# EAGLE design XBP-ST_morpho (EAGLE 7.2.0)
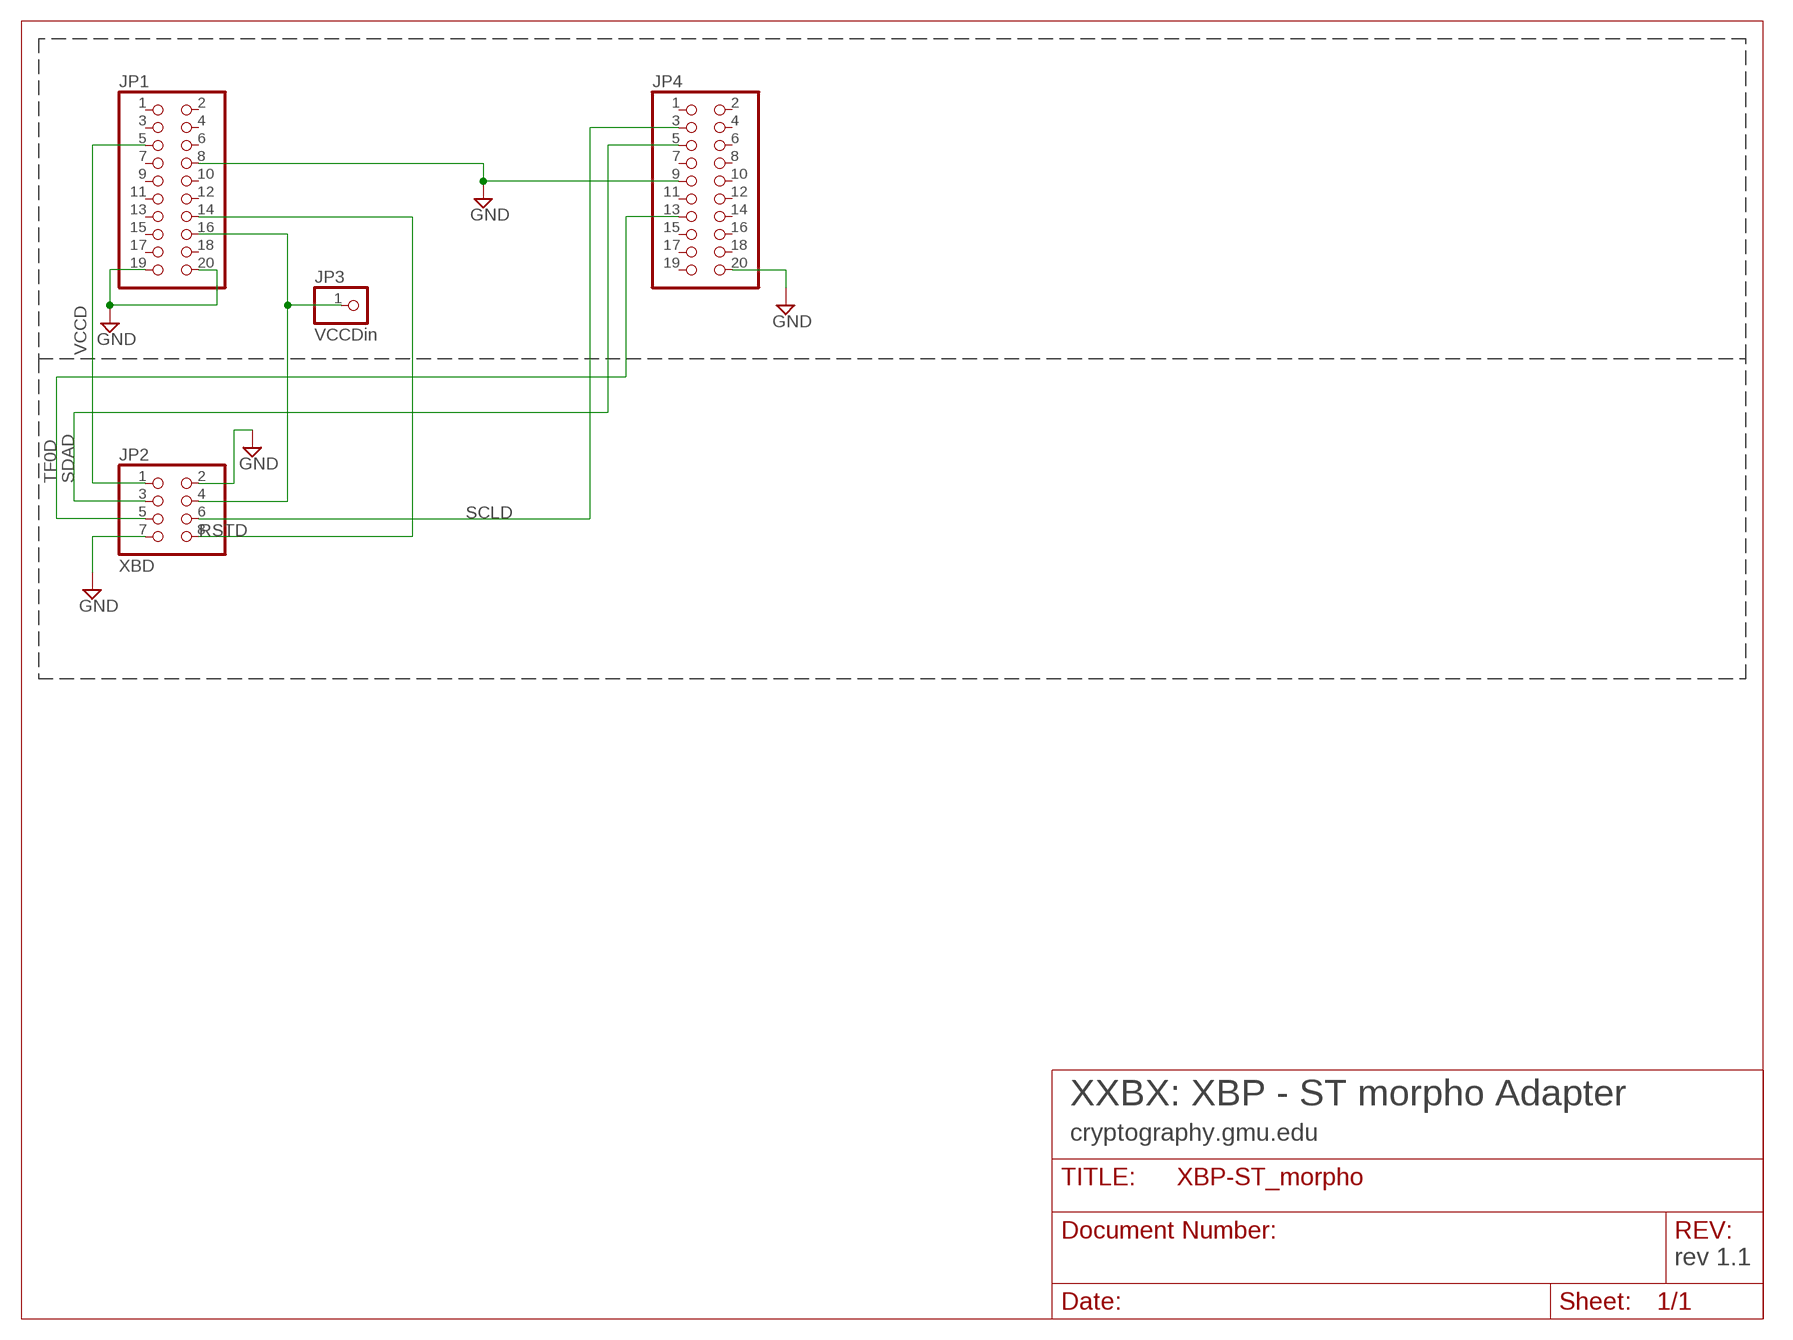
[diagram p0: schematic, sheet 1]

## Parts
JP1  PINHD-2X10  [2X10]
JP2  XBD  PINHD-2X4/90  [2X04/90]
JP3  VCCDin  PINHD-1X1  [1X01]
JP4  PINHD-2X10  [2X10]

## Nets
GND: JP1.8 JP1.19 JP1.20 JP2.2 JP2.7 JP4.9 JP4.20
N$6: JP1.16 JP2.4 JP3.1
RSTD: JP1.14 JP2.8
SCLD: JP2.6 JP4.3
SDAD: JP2.3 JP4.5
TF0D: JP2.5 JP4.13
VCCD: JP1.5 JP2.1
Unconnected: JP1.1 JP1.2 JP1.3 JP1.4 JP1.6 JP1.7 JP1.9 JP1.10 JP1.11 JP1.12 JP1.13 JP1.15 JP1.17 JP1.18 JP4.1 JP4.2 JP4.4 JP4.6 JP4.7 JP4.8 JP4.10 JP4.11 JP4.12 JP4.14 JP4.15 JP4.16 JP4.17 JP4.18 JP4.19

## Notes on the sheet
- XXBX: XBP - ST morpho Adapter
- cryptography.gmu.edu
- rev 1.1

## Library data of the parts
JP1 JP4 = pinhead:PINHD-2X10: PIN HEADER
JP2 = pinhead:PINHD-2X4: PIN HEADER
JP3 = pinhead:PINHD-1X1: PIN HEADER

## Board
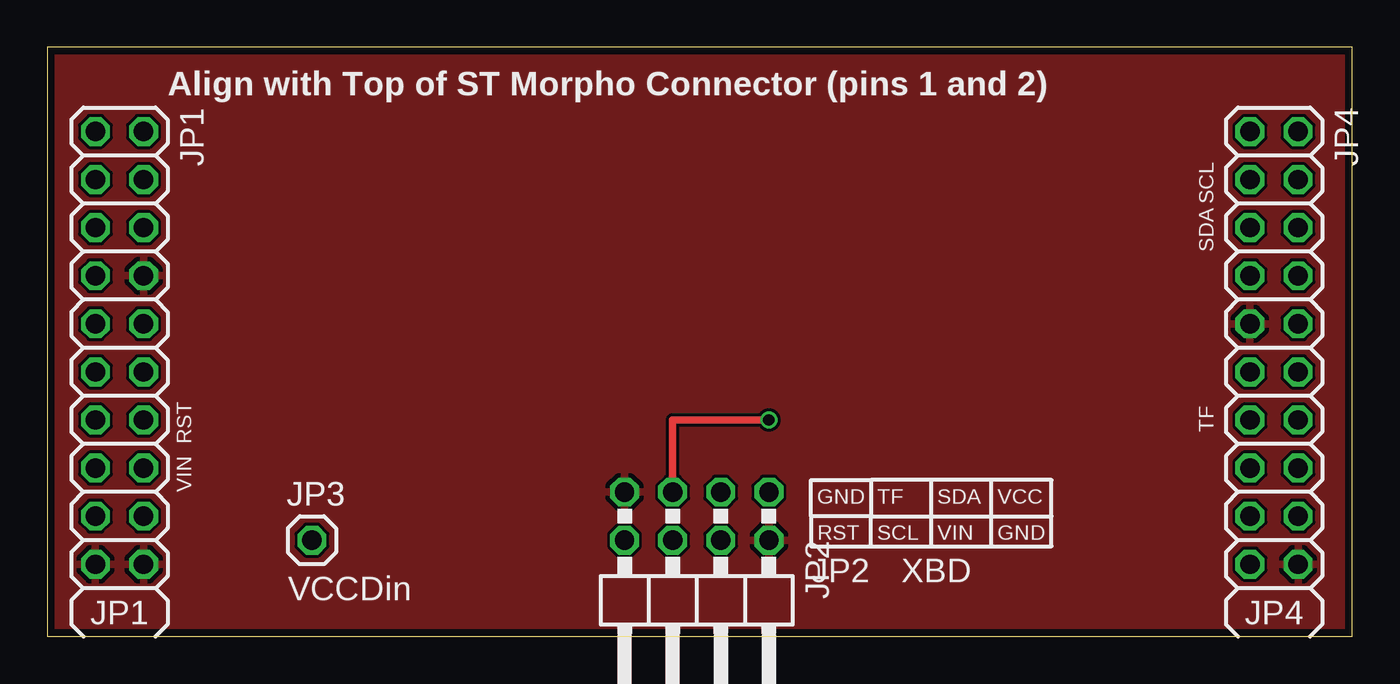
[diagram p1: board, top side]
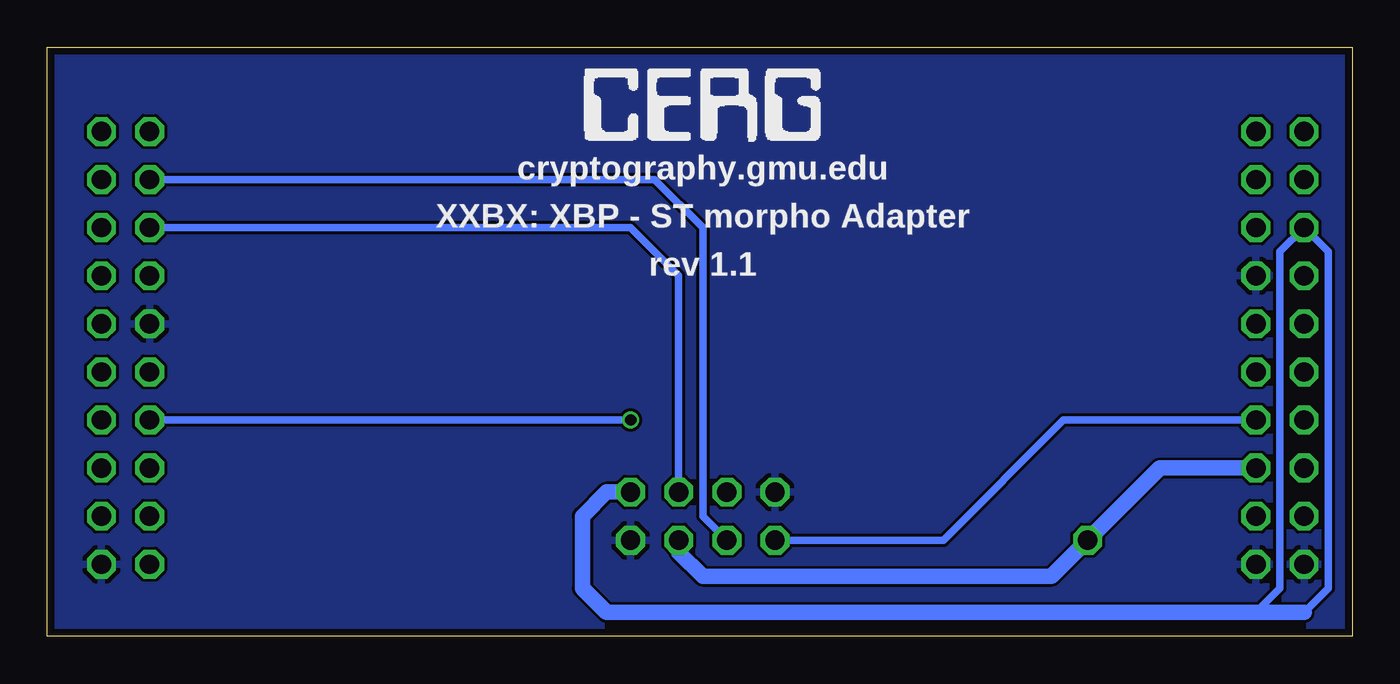
[diagram p2: board, bottom side, seen from below]

Size 68.9 x 31.11 mm. Coordinates in mm from the lower left corner, seen from the top.
Outline: 0,0 68.9,0 68.9,31.11 0,31.11 0,0
Copper layers (1*16): Top 0.035559375mm / dielectric 1.6mm / Bottom 0.035559375mm
Design rules "oshpark-2layer *": minimum track width 6mil, minimum drill 10mil, track to track 6mil, track to pad 6mil, pad to pad 6mil, via to via 6mil, smd to smd 0mil, copper to edge 15mil, drill to drill 6mil, minimum pad ring 5mil, minimum via ring 5mil, stop-mask expansion 2.5mil, vias tented up to drill 30mil, thermal gap 10mil

### Footprints (pad centres in the part's own frame; a part is rotated, then mirrored left to right if it is on the bottom)
2X10 = drill 1.016 octagon: 1 -11.43,-1.27; 2 -11.43,1.27; 3 -8.89,-1.27; 4 -8.89,1.27; 5 -6.35,-1.27; 6 -6.35,1.27; 7 -3.81,-1.27; 8 -3.81,1.27; 9 -1.27,-1.27; 10 -1.27,1.27; 11 1.27,-1.27; 12 1.27,1.27; 13 3.81,-1.27; 14 3.81,1.27; 15 6.35,-1.27; 16 6.35,1.27; 17 8.89,-1.27; 18 8.89,1.27; 19 11.43,-1.27; 20 11.43,1.27
2X04/90 = drill 1.016 octagon: 1 -3.81,-6.35; 2 -3.81,-3.81; 3 -1.27,-6.35; 4 -1.27,-3.81; 5 1.27,-6.35; 6 1.27,-3.81; 7 3.81,-6.35; 8 3.81,-3.81
1X01 = drill 1.016 octagon: 1 0,0

### Placement (x,y rotation side)
JP1  3.81,15.24 270 top
JP2  34.29,1.27 180 top
JP3  13.97,5.08 0 top
JP4  64.77,15.24 270 top

### Tracks (layer width: path | path; a pad name or v marks a point on that pad's centre or on a via)
GND
  pour Top: 68.9,31.11 68.9,0 0,0 0,31.11
  pour Bottom: 68.9,31.11 68.9,0 0,0 0,31.11
N$6
  Bottom 0.813: JP2.4 35.56,4.45 34.29,3.17 15.88,3.17 JP3.1 10.16,8.89 JP1.16
RSTD
  Bottom 0.406: JP1.14 15.24,11.43 21.59,5.08 JP2.8
SCLD
  Bottom 0.406: JP2.6 34.29,6.35 34.29,21.59 36.83,24.13 JP4.3
SDAD
  Bottom 0.406: JP2.3 35.56,19.05 38.1,21.59 JP4.5
TF0D  (via drill 0.6)
  Top 0.406: JP2.5 33.02,11.43 v38.1,11.43
  Bottom 0.406: v38.1,11.43 JP4.13
VCCD
  Bottom 0.406: JP1.5 3.81,20.32 3.81,2.54 5.08,1.27 2.54,1.27 1.27,2.54 1.27,20.32 JP1.5
  Bottom 0.813: JP2.1 39.37,7.62 40.64,6.35 40.64,2.54 39.37,1.27 2.54,1.27

### Text on the board
_tsilk: Align with Top of ST Morpho Connector (pins 1 and 2) | SCL | SDA | TF | RST | VIN | JP3 | GND | TF | SDA | VCC | RST | SCL | VIN | GND | JP2 | XBD | VCCDin | JP1 | JP4
_bsilk: cryptography.gmu.edu | XXBX: XBP - ST morpho Adapter | rev 1.1